# Altium schematic sheet MyKeyboard_Core.SchDoc
size A4; SheetNumber: 1; SheetTotal: 1
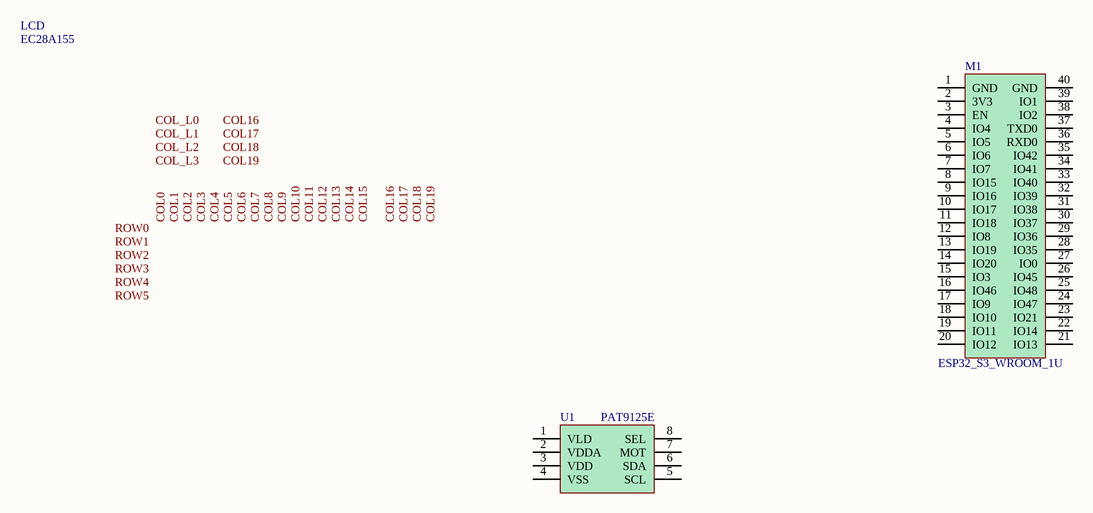
[diagram p0: MyKeyboard_Core.SchDoc]

## Parts
M1  ESP32_S3_WROOM_1U  [ESP32_S3_WROOM_1U]
U1  PAT9125E  [PAT9125EL]

## Nets

Not connected (* = marked no-connect by the designer): M1 1(GND) 2(3V3) 3(EN) 4(IO4) 5(IO5) 6(IO6) 7(IO7) 8(IO15) 9(IO16) 10(IO17) 11(IO18) 12(IO8) 13(IO19) 14(IO20) 15(IO3) 16(IO46) 17(IO9) 18(IO10) 19(IO11) 20(IO12) 21(IO13) 22(IO14) 23(IO21) 24(IO47) 25(IO48) 26(IO45) 27(IO0) 28(IO35) 29(IO36) 30(IO37) 31(IO38) 32(IO39) 33(IO40) 34(IO41) 35(IO42) 36(RXD0) 37(TXD0) 38(IO2) 39(IO1) 40(GND); U1 1(VLD) 2(VDDA) 3(VDD) 4(VSS) 5(SCL) 6(SDA) 7(MOT) 8(SEL)

## Notes on the sheet
- LCD
- EC28A155
- Labels drawn without touching a wire or pin: COL0, COL1, COL2, COL3, COL4, COL5, COL6, COL7, COL8, COL9, COL10, COL11, COL12, COL13, COL14, COL15, COL16, COL17, COL18, COL19, COL_L0, COL_L1, COL_L2, COL_L3, ROW0, ROW1, ROW2, ROW3, ROW4, ROW5

## Library data of the parts
M1 = ESP32_S3_WROOM_1U: ESP32 S3模组
U1 = PAT9125EL: 光流追踪